# EAGLE design DMD_TWI (EAGLE 4.16)
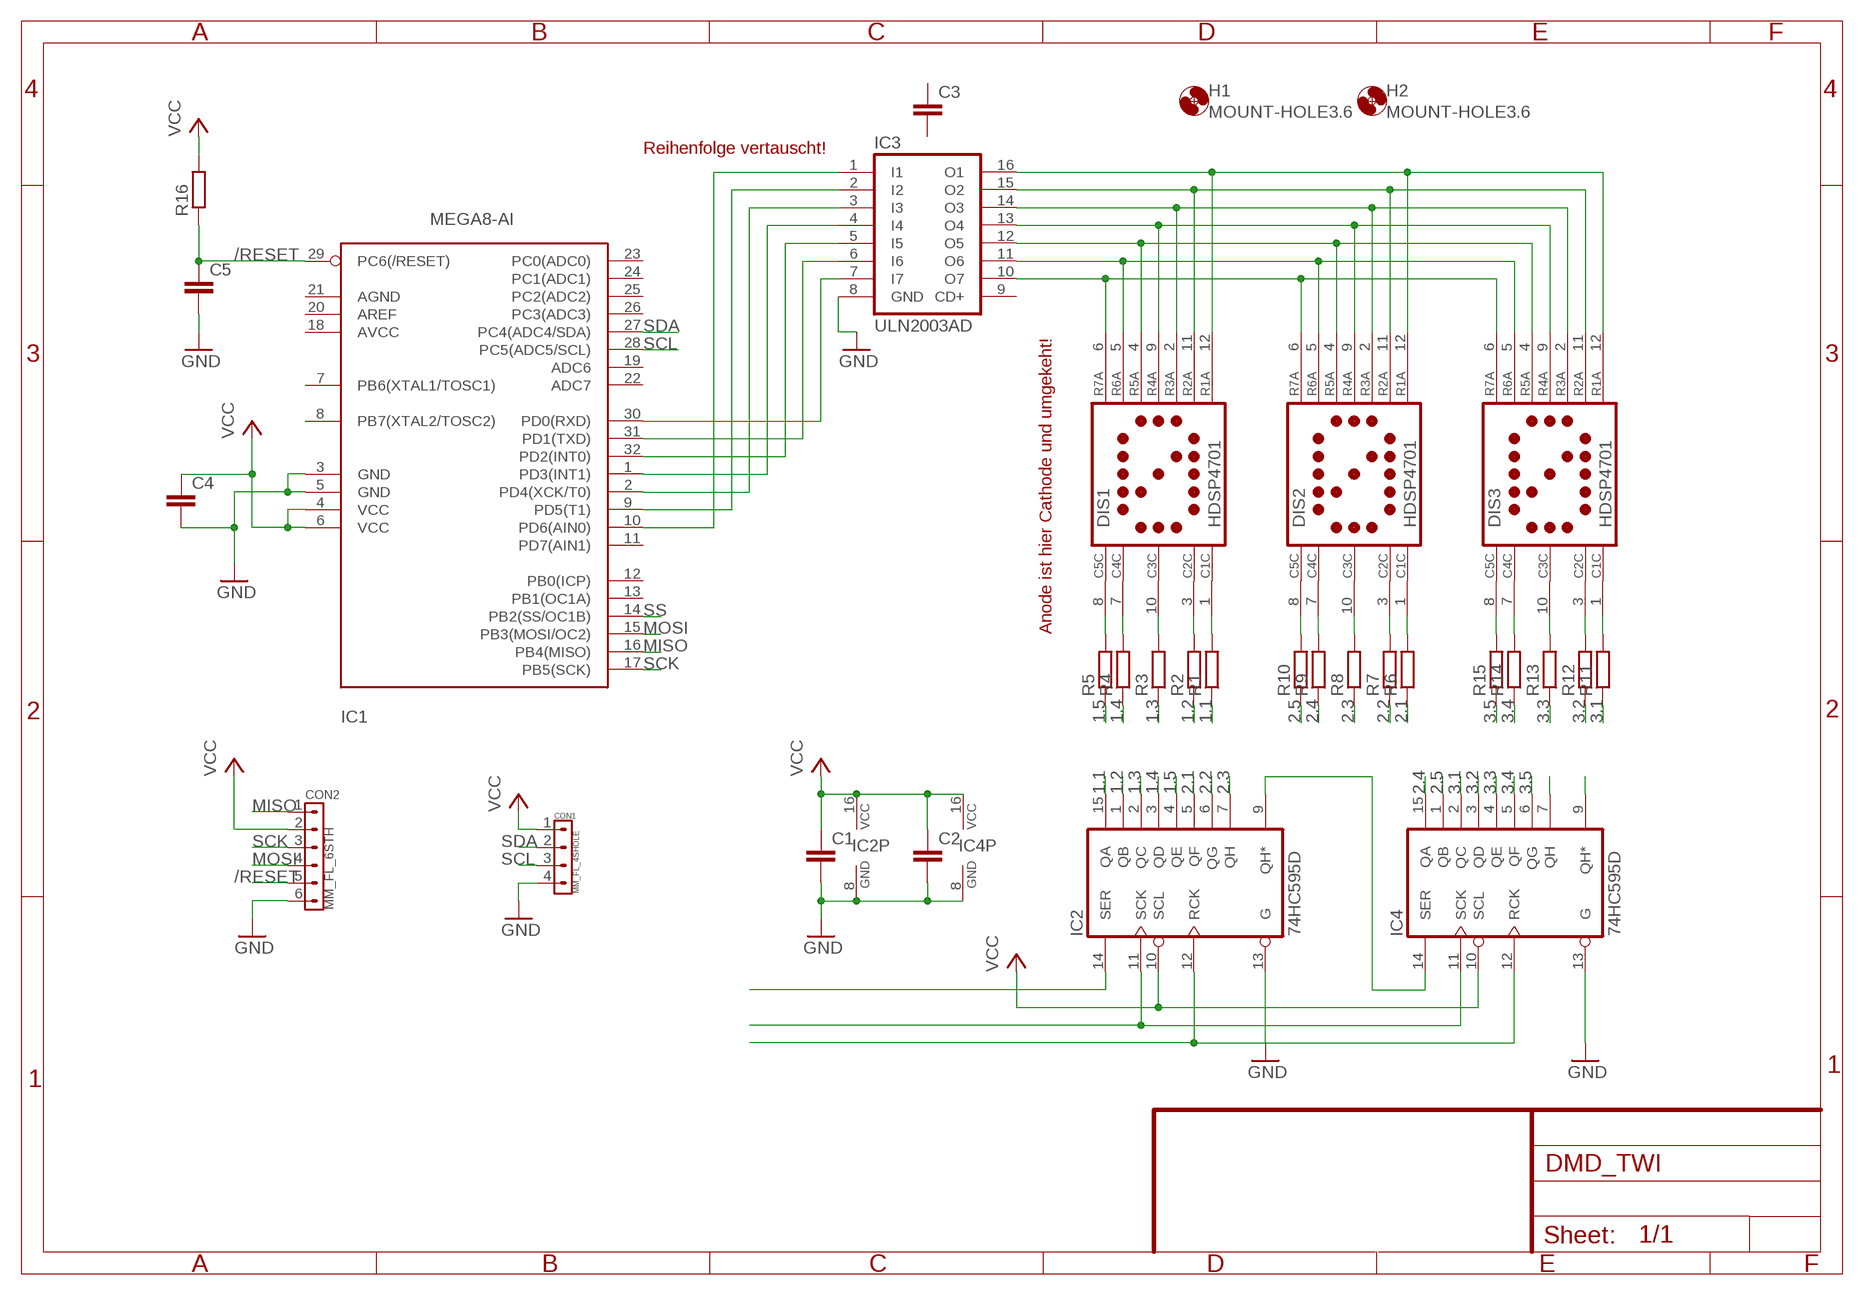
[diagram p0: schematic, sheet 1]

## Parts
C1  C-EUC0603  [C0603]
C2  C-EUC0603  [C0603]
C3  C-EUC0603  [C0603]
C4  C-EUC0603  [C0603]
C5  C-EUC0603  [C0603]
CON1  MM_FL_4SHOLE  [MM_FL_4G]
CON2  MM_FL_6STH  [MM_FL_6G]
DIS1  HDSP4701  [HDSP47]
DIS2  HDSP4701  [HDSP47]
DIS3  HDSP4701  [HDSP47]
H1  MOUNT-HOLE3.6  [3,6]
H2  MOUNT-HOLE3.6  [3,6]
IC1  MEGA8-AI  [TQFP32-08]
IC2  74HC595D  [SO16]
IC3  ULN2003AD  [SO16]
IC4  74HC595D  [SO16]
R1  R-EU_R0603  [R0603]
R2  R-EU_R0603  [R0603]
R3  R-EU_R0603  [R0603]
R4  R-EU_R0603  [R0603]
R5  R-EU_R0603  [R0603]
R6  R-EU_R0603  [R0603]
R7  R-EU_R0603  [R0603]
R8  R-EU_R0603  [R0603]
R9  R-EU_R0603  [R0603]
R10  R-EU_R0603  [R0603]
R11  R-EU_R0603  [R0603]
R12  R-EU_R0603  [R0603]
R13  R-EU_R0603  [R0603]
R14  R-EU_R0603  [R0603]
R15  R-EU_R0603  [R0603]
R16  R-EU_R0603  [R0603]

## Nets
1.1: IC2.15(QA) R1.1
1.2: IC2.1(QB) R2.1
1.3: IC2.2(QC) R3.1
1.4: IC2.3(QD) R4.1
1.5: IC2.4(QE) R5.1
2.1: IC2.5(QF) R6.1
2.2: IC2.6(QG) R7.1
2.3: IC2.7(QH) R8.1
2.4: IC4.15(QA) R9.1
2.5: IC4.1(QB) R10.1
3.1: IC4.2(QC) R11.1
3.2: IC4.3(QD) R12.1
3.3: IC4.4(QE) R13.1
3.4: IC4.5(QF) R14.1
3.5: IC4.6(QG) R15.1
/RESET: C5.1 CON2.5 IC1.29(PC6(/RESET)) R16.1
GND: C1.2 C2.2 C4.2 C5.2 CON1.4 CON2.6 IC1.3(GND) IC1.5(GND) IC2.8(GND) IC2.13(G) IC3.8(GND) IC4.8(GND) IC4.13(G)
MISO: CON2.1 IC1.16(PB4(MISO))
MOSI: CON2.4 IC1.15(PB3(MOSI/OC2))
N$1: DIS1.6(R7A) DIS2.6(R7A) DIS3.6(R7A) IC3.10(O7)
N$2: DIS1.5(R6A) DIS2.5(R6A) DIS3.5(R6A) IC3.11(O6)
N$3: DIS1.4(R5A) DIS2.4(R5A) DIS3.4(R5A) IC3.12(O5)
N$4: DIS1.9(R4A) DIS2.9(R4A) DIS3.9(R4A) IC3.13(O4)
N$5: DIS1.2(R3A) DIS2.2(R3A) DIS3.2(R3A) IC3.14(O3)
N$6: DIS1.11(R2A) DIS2.11(R2A) DIS3.11(R2A) IC3.15(O2)
N$7: DIS1.12(R1A) DIS2.12(R1A) DIS3.12(R1A) IC3.16(O1)
N$8: DIS1.8(C5C) R5.2
N$9: DIS1.7(C4C) R4.2
N$10: DIS1.10(C3C) R3.2
N$11: DIS1.3(C2C) R2.2
N$12: DIS1.1(C1C) R1.2
N$13: DIS2.8(C5C) R10.2
N$14: DIS2.7(C4C) R9.2
N$15: DIS2.10(C3C) R8.2
N$16: DIS2.3(C2C) R7.2
N$17: DIS2.1(C1C) R6.2
N$18: DIS3.8(C5C) R15.2
N$19: DIS3.7(C4C) R14.2
N$20: DIS3.10(C3C) R13.2
N$21: DIS3.3(C2C) R12.2
N$22: DIS3.1(C1C) R11.2
N$23: IC2.11(SCK) IC4.11(SCK)
N$24: IC2.14(SER)
N$25: IC2.12(RCK) IC4.12(RCK)
N$26: IC1.30(PD0(RXD)) IC3.7(I7)
N$27: IC1.31(PD1(TXD)) IC3.6(I6)
N$28: IC1.32(PD2(INT0)) IC3.5(I5)
N$29: IC1.1(PD3(INT1)) IC3.4(I4)
N$30: IC1.2(PD4(XCK/T0)) IC3.3(I3)
N$31: IC1.9(PD5(T1)) IC3.2(I2)
N$32: IC1.10(PD6(AIN0)) IC3.1(I1)
N$46: IC2.9(QH*) IC4.14(SER)
N$54: IC4.7(QH)
N$55: IC4.9(QH*)
SCK: CON2.3 IC1.17(PB5(SCK))
SCL: CON1.3 IC1.28(PC5(ADC5/SCL))
SDA: CON1.2 IC1.27(PC4(ADC4/SDA))
SS: IC1.14(PB2(SS/OC1B))
VCC: C1.1 C2.1 C4.1 CON1.1 CON2.2 IC1.4(VCC) IC1.6(VCC) IC2.10(SCL) IC2.16(VCC) IC4.10(SCL) IC4.16(VCC) R16.2
Unconnected: C3.1 C3.2 IC1.7(PB6(XTAL1/TOSC1)) IC1.8(PB7(XTAL2/TOSC2)) IC1.11(PD7(AIN1)) IC1.12(PB0(ICP)) IC1.13(PB1(OC1A)) IC1.18(AVCC) IC1.19(ADC6) IC1.20(AREF) IC1.21(AGND) IC1.22(ADC7) IC1.23(PC0(ADC0)) IC1.24(PC1(ADC1)) IC1.25(PC2(ADC2)) IC1.26(PC3(ADC3)) IC3.9(CD+)

## Notes on the sheet
- Reihenfolge vertauscht!
- Anode ist hier Cathode und umgekeht!

## Library data of the parts
C1-C5 = rcl:C-EU: CAPACITOR, European symbol
CON1 = marcus:MM_FL_4S: Miniatru Print Stecker SMD 4 Kontakte Reichelt Bestellnummer: MM FL 4S Created by Marcus Knips 4/2013
CON2 = marcus:MM_FL_6S: Miniatru Print Stecker SMD 6 Kontakte Reichelt Bestellnummer: MM FL 6S Created by Marcus Knips 4/2013
DIS1-DIS3 = test:HDSP4701: LED DISPLAY 1-character dot matrix without decimal point
H1 H2 = holes:MOUNT-HOLE: MOUNTING HOLE with drill center marker
IC1 = atmel:MEGA8: MICROCONTROLLER 8 Kbytes FLASH 1 kbytes SRAM 512 bytes EEPROM USART 6-channel 10 bit ADC 2-channel 8 bit ADC Source: avr.lbr
IC2 IC4 = 74xx-eu:74*595: 8-bit SHIFT REGISTER, output latch
IC3 = uln-udn:ULN2003A: DRIVER ARRAY
R1-R16 = rcl:R-EU_: RESISTOR, European symbol

## Board
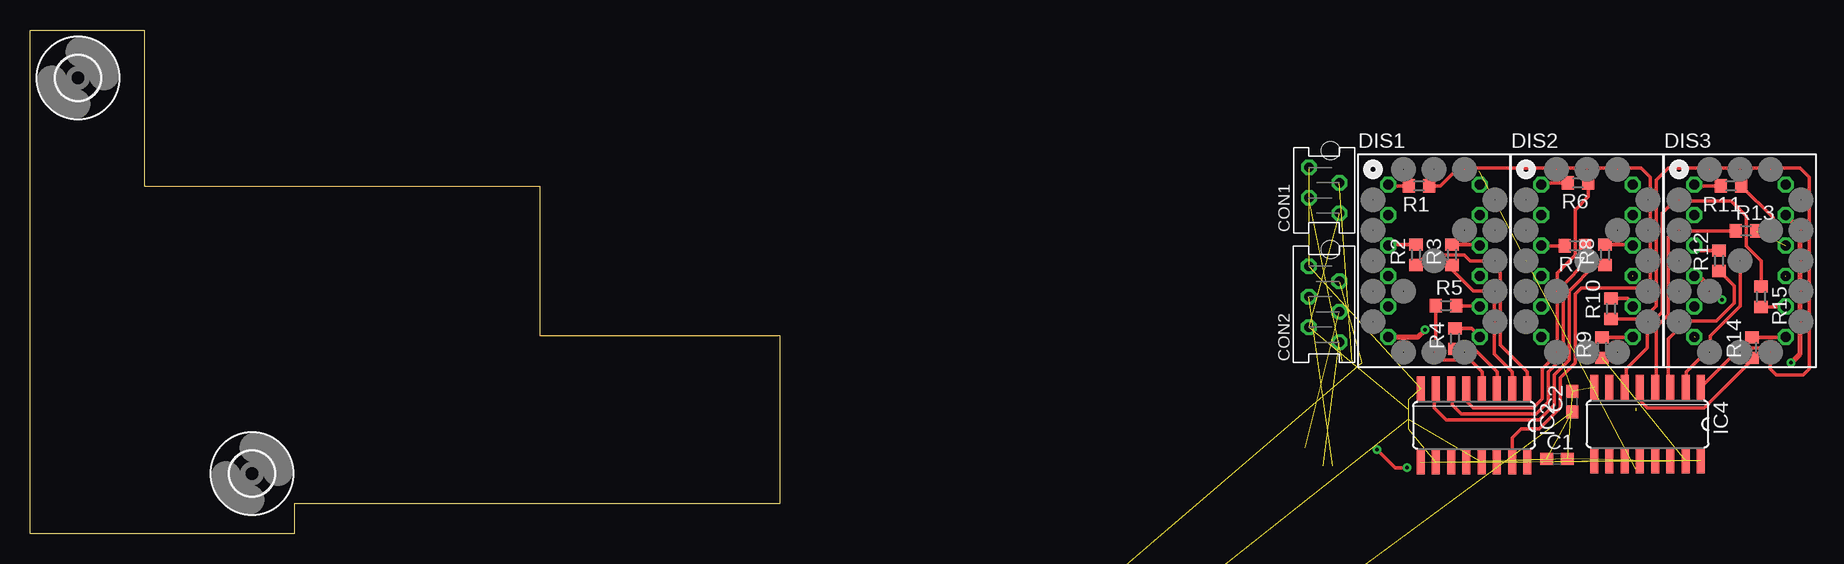
[diagram p1: board, top side]
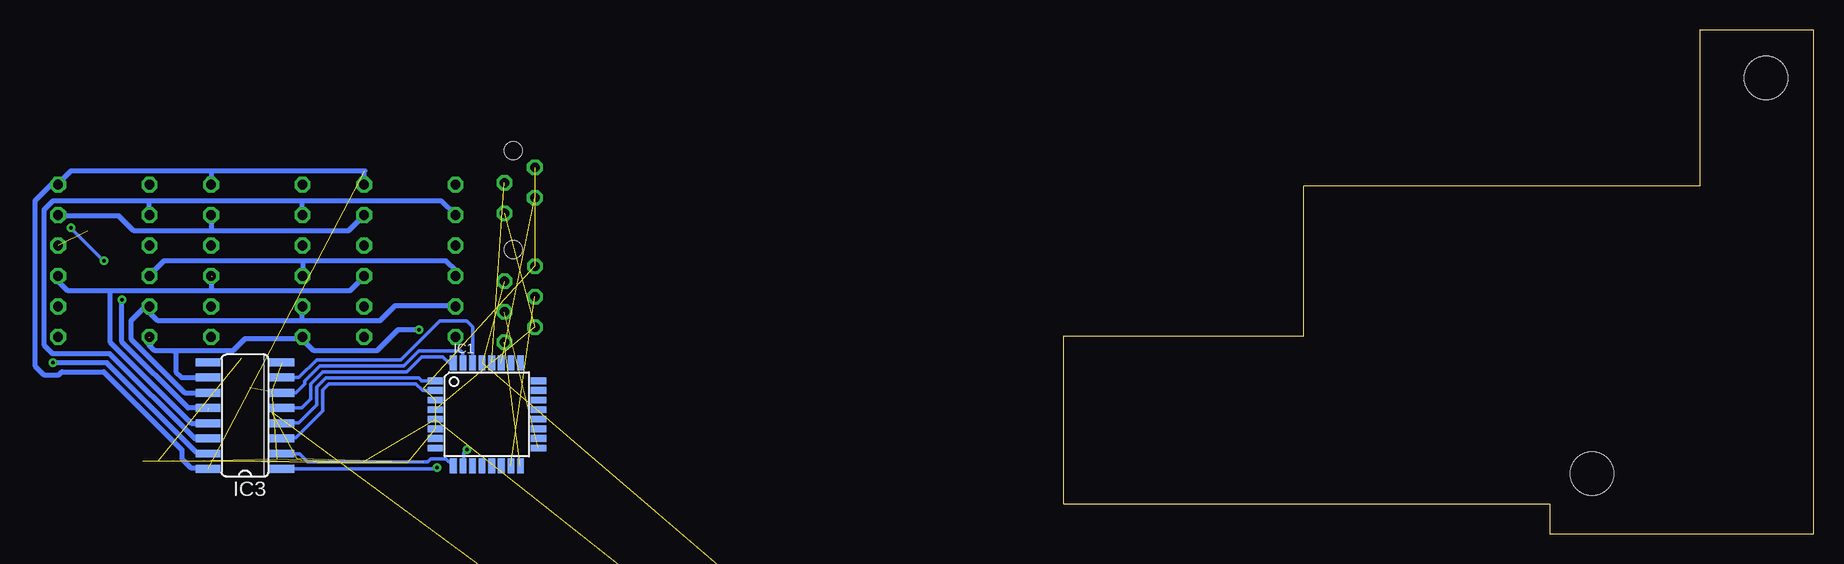
[diagram p2: board, bottom side, seen from below]

Size 62.5 x 42 mm. Coordinates in mm from the lower left corner, seen from the top.
Outline: 0,0 0,42 9.5,42 9.5,29 42.5,29 42.5,16.5 62.5,16.5 62.5,2.5 22,2.5 22,0 0,0
Copper layers (1*16): Top 0.035mm / dielectric 1.5mm / Bottom 0.035mm
Design rules "default": minimum track width 10mil, minimum drill 24mil, track to track 8mil, track to pad 8mil, pad to pad 8mil, via to via 8mil, smd to smd 8mil, copper to edge 40mil, drill to drill 8mil, minimum pad ring 10mil, minimum via ring 8mil, stop-mask expansion 4mil, vias tented up to drill 0mil, thermal gap 10mil

### Footprints (pad centres in the part's own frame; a part is rotated, then mirrored left to right if it is on the bottom)
C0603 = smd 1.1 x 1: 1 -0.85,0; 2 0.85,0
MM_FL_4G = drill 0.8 octagon: 1 0,-1.27; 2 1.27,1.27; 3 2.54,-1.27; 4 3.81,1.27 | hole 1.5: 5.21,-0.53
MM_FL_6G = drill 0.8 octagon: 1 -2.54,-1.27; 2 -1.27,1.27; 3 0,-1.27; 4 1.27,1.27; 5 2.54,-1.27; 6 3.81,1.27 | hole 1.5: 5.21,-0.53
HDSP47 = drill 0.813 octagon: 1 -3.81,6.35; 2 -3.81,3.81; 3 -3.81,1.27; 4 -3.81,-1.27; 5 -3.81,-3.81; 6 -3.81,-6.35; 7 3.81,-6.35; 8 3.81,-3.81; 9 3.81,-1.27; 10 3.81,1.27; 11 3.81,3.81; 12 3.81,6.35
3,6 = hole 3.6: 0,0
TQFP32-08 = smd 1.27 x 0.559: 1 -4.293,2.8; 2 -4.293,2; 3 -4.293,1.2; 4 -4.293,0.4; 5 -4.293,-0.4; 6 -4.293,-1.2; 7 -4.293,-2; 8 -4.293,-2.8; 17 4.293,-2.8; 18 4.293,-2; 19 4.293,-1.2; 20 4.293,-0.4; 21 4.293,0.4; 22 4.293,1.2; 23 4.293,2; 24 4.293,2.8 | smd 0.559 x 1.27: 9 -2.8,-4.293; 10 -2,-4.293; 11 -1.2,-4.293; 12 -0.4,-4.293; 13 0.4,-4.293; 14 1.2,-4.293; 15 2,-4.293; 16 2.8,-4.293; 25 2.8,4.293; 26 2,4.293; 27 1.2,4.293; 28 0.4,4.293; 29 -0.4,4.293; 30 -1.2,4.293; 31 -2,4.293; 32 -2.8,4.293
SO16 = smd 0.66 x 2.032: 1 -4.445,-3.073; 2 -3.175,-3.073; 3 -1.905,-3.073; 4 -0.635,-3.073; 5 0.635,-3.073; 6 1.905,-3.073; 7 3.175,-3.073; 8 4.445,-3.073; 9 4.445,3.073; 10 3.175,3.073; 11 1.905,3.073; 12 0.635,3.073; 13 -0.635,3.073; 14 -1.905,3.073; 15 -3.175,3.073; 16 -4.445,3.073
R0603 = smd 1 x 1.1: 1 -0.85,0; 2 0.85,0

### Placement (x,y rotation side)
C1  127.25,6.25 0 top  (outside the outline)
C2  128.5,11 90 top  (outside the outline)
C3  -83.55,-140.7 0 top  (outside the outline)
C4  -83.55,-147.05 0 top  (outside the outline)
C5  -83.55,-153.4 0 top  (outside the outline)
CON1  107.85,26.72 90 top  (outside the outline)
CON2  107.84,18.49 90 top  (outside the outline)
DIS1  117,22.75 0 top  (outside the outline)
DIS2  129.75,22.75 0 top  (outside the outline)
DIS3  142.5,22.75 0 top  (outside the outline)
H1  18.5,5 0 top
H2  4,38 0 top
IC1  110.58,9.94 0 bottom  (outside the outline)
IC2  120.33,9.02 180 top  (outside the outline)
IC3  130.73,9.84 90 bottom  (outside the outline)
IC4  134.79,9.12 180 top  (outside the outline)
R1  115.75,29 180 top  (outside the outline)
R2  115.5,23.25 90 top  (outside the outline)
R3  118.5,23.25 90 top  (outside the outline)
R4  118.75,16.25 90 top  (outside the outline)
R5  118,19 0 top  (outside the outline)
R6  129,29.25 180 top  (outside the outline)
R7  128.75,24 180 top  (outside the outline)
R8  131.25,23.25 90 top  (outside the outline)
R9  131,15.5 90 top  (outside the outline)
R10  131.75,18.75 90 top  (outside the outline)
R11  141.75,29 180 top  (outside the outline)
R12  140.75,22.75 90 top  (outside the outline)
R13  143,25.25 0 top  (outside the outline)
R14  143.5,15.5 90 top  (outside the outline)
R15  144.25,19.75 270 top  (outside the outline)
R16  -82.28,-159.75 0 top  (outside the outline)

### Tracks (layer width: path | path; a pad name or v marks a point on that pad's centre or on a via)
1.1
  Top 0.3: R1.1 117.5,29 119,30.5 134.25,30.5 135,29.75 135,21.25 134.25,20.5 129.25,20.5 128.75,20 128.75,14.25 127.5,13 127.5,10.5 125.75,8.75 124.25,8.75 123.5,8 123.5,6 IC2.15
1.2
  Top 0.3: R2.1 116.35,23.25 119.5,23.25 120,22.75 121.5,22.75 122.5,21.75 122.5,15.75 124.75,13.5 124.75,12.25 124.78,12.22 IC2.1
  Top 0.4: R2.1 115.5,22.5
1.3
  Top 0.3: R3.1 118.5,22 120.25,20.25 121.25,20.25 122,19.5 122,15 123.5,13.5 123.5,12 123.5,12.01 IC2.2
1.4
  Top 0.3: R4.1 120.35,15.4 122.25,13.5 122.25,12 122.23,12.02 IC2.3
1.5
  Top 0.3: R5.1 117.15,15.1 117.75,14.5 120,14.5 121,13.5 121,12 120.97,12.04 IC2.4
2.1
  Top 0.3: R6.1 129.85,28.1 128.75,27 128.75,23.25 127.25,21.75 127.25,15 126,13.75 126,11.25 125.25,10.5 120.25,10.5 119.75,11 119.75,12.25 119.69,12.2 IC2.5
2.2
  Top 0.3: R7.1 129.6,22.6 127.75,20.75 127.75,14.75 126.5,13.5 126.5,11 125.5,10 119.25,10 118.5,10.75 118.5,12 118.42,12.07 IC2.6
2.3
  Top 0.3: R8.1 130.4,22.4 128.25,20.25 128.25,14.5 127,13.25 127,10.75 125.75,9.5 118,9.5 117,10.5 117,11.75 117.25,12 IC2.7
2.4  (1 unrouted)
2.5
  Top 0.3: R10.1 134.4,17.9 135.5,19 135.5,29.5 136.5,30.5 147.5,30.5 148.25,29.75 148.25,13.75 147.75,13.25 145.5,13.25 145,13.75 145,15.25 144.75,15.5 142.5,15.5 139.25,12.25 | 139.25,12.25 139.24,12.23 IC4.1 139.25,12.21 139.25,12.25
3.1  (via drill 0.3)
  Top 0.3: R11.1 145.25,26.35 v145.25,25.5 | v142.5,22.75 142.5,19 140,16.5 140,15.5 138,13.5 138,12.23 IC4.2
  Bottom 0.3: v145.25,25.5 v142.5,22.75
3.2
  Top 0.3: R12.1 142,20.65 142,19.25 140.5,17.75 138,17.75 136.5,16.25 136.5,12.25 136.64,12.25 IC4.3
3.3
  Top 0.3: R13.1 137,25.25 136.5,24.75 136.5,18.25 135.5,17.25 135.5,12.25 135.48,12.25 IC4.4
3.4
  Top 0.3: R14.1 143.5,14.5 139.5,10.5 134.75,10.5 134.25,11 134.25,12.25 134.19,12.19 IC4.5
3.5
  Top 0.3: R15.1 144.25,22.75 143,24 143,26.5 141.75,27.75 137,27.75 136,26.75 136,18.5 134.75,17.25 134.75,15.5 133,13.75 133,12.25 132.94,12.19 IC4.6
/RESET  (3 unrouted)
GND  (12 unrouted)
MISO  (1 unrouted)
MOSI  (1 unrouted)
N$1  (via drill 0.3)  (1 unrouted)
  Top 0.4: DIS1.6 115.65,16.4 v116.25,17
  Bottom 0.4: 136.75,15.25 136.5,15.25 136.5,13.5 136.01,13.02 IC3.10 | 136.75,15.25 138.25,15.25 138.75,15.75 138.75,16.34 | 126,16.25 130.75,16.25 131.75,15.25 136.75,15.25 | 118.75,16.25 119.75,15.25 125,15.25 126,16.25 | 118.75,16.25 118.69,16.31 | 126,16.25 125.94,16.31 DIS2.6 | v116.25,17 118,17 118.75,16.25
N$2
  Bottom 0.4: 126,17.75 138,17.75 138.75,18.5 138.75,19 DIS3.5 138.94,18.94 139,19 140.25,17.75 140.25,16.25 135.75,11.75 IC3.11 | IC3.11 133.75,11.75 | IC3.11 | DIS1.5 113.25,19 118.25,19 119.5,17.75 126,17.75 | DIS2.5 126,19 126,17.75
N$3  (via drill 0.3)  (1 unrouted)
  Top 0.4: DIS3.4 138.71,21.5 139,21.5 v141,19.5
  Bottom 0.4: DIS1.4 113.19,21.94 114,22.75 126,22.75 | DIS3.4 138.73,21.48 138.75,21.5 137.5,22.75 126,22.75 | DIS2.4 125.94,22.69 126,22.75 | IC3.12 135.47,10.47 141,16 v141,19.5
N$4  (2 unrouted)
  Bottom 0.4: 133.5,20.25 142,20.25 | 142,20.25 145.5,20.25 146.25,21 146.25,21.5 146.29,21.5 | 133.5,20.25 133.5,21.42 | 120.77,21.48 120.75,21.5 | DIS1.9 120.77,21.48 | 133.5,20.25 122,20.25 120.77,21.48 | IC3.13 135.21,9.21 142,16 142,20.25
N$5
  Bottom 0.4: DIS1.2 114.38,27.75 126,27.75 | 126,27.75 138.75,27.75 | DIS3.2 138.75,26.62 138.75,27.75 | DIS2.2 126,26.62 126,27.75 | 138.75,27.75 146.75,27.75 147.5,27 147.5,15.75 146.75,15 142,15 134.94,7.94 IC3.14
N$6  (via drill 0.3)
  Top 0.4: v146.75,14.25 147.5,15 147.5,25.37 146.37,26.5 146.25,26.5 DIS3.11
  Bottom 0.4: DIS1.11 122.12,25.25 133.5,25.25 | DIS2.11 133.5,26.5 133.5,25.25 | IC3.15 133.8,6.7 133.75,6.75 134.75,6.75 142.25,14.25 v146.75,14.25 | 133.5,25.25 140,25.25 141.25,26.5 146.25,26.5 DIS3.11
N$7  (1 unrouted)
  Bottom 0.4: 133.5,30.25 120.75,30.25 120.81,30.19 DIS1.12 | 133.5,30.25 145.25,30.25 146.31,29.19 DIS3.12 146.9,29.1 148.25,27.75 148.25,14 147.5,13.25 146.25,13.25 146,13.5 142.5,13.5 136,7 136,6.25 135.25,5.5 133.75,5.5 133.8,5.45 IC3.16 | DIS2.12 133.56,30.19 133.5,30.25
N$8
  Top 0.3: DIS1.8 120.75,19 R5.2
N$9
  Top 0.3: 121,16.25 120.85,16.4 | 120.85,16.4 DIS1.7 | R4.2 120.15,17.1 120.85,16.4
N$10
  Top 0.3: DIS1.10 120.77,24.02 120.75,24 120.65,24.1 R3.2
N$11
  Top 0.3: DIS1.3 113.23,24.02 113.25,24 113.35,24.1 R2.2
N$12
  Top 0.3: DIS1.1 113.19,29.06 113.25,29 R1.2
N$13
  Top 0.3: DIS2.8 133.69,18.94 133.75,19 133.15,19.6 R10.2
N$14
  Top 0.3: DIS2.7 133.56,16.44 133.5,16.5 133.35,16.35 R9.2
N$15
  Top 0.3: 133.75,24 133.73,24.02 | 133.73,24.02 DIS2.10 | R8.2 133.65,24.1 133.73,24.02
N$16
  Top 0.3: DIS2.3 125.98,24.02 126,24 R7.2
N$17
  Top 0.3: DIS2.1 125.94,29.06 126,29 126.25,29.25 R6.2
N$18
  Top 0.3: DIS3.8 146.25,19 146.15,18.9 R15.2
N$19
  Top 0.3: 146.5,16.5 146.4,16.4 | 146.4,16.4 DIS3.7 | R14.2 146.35,16.35 146.4,16.4
N$20  (1 unrouted)
N$21
  Top 0.3: DIS3.3 138.73,24.02 139.15,23.6 R12.2
N$22
  Top 0.3: 138.5,29.25 138.65,29.1 | 138.65,29.1 DIS3.1 | R11.2 138.75,29 138.65,29.1
N$23  (1 unrouted)
N$25  (1 unrouted)
N$26
  Bottom 0.3: IC3.7 126.23,13.02 124.75,14.5 117.75,14.5 114.5,17.75 112.25,17.75 111.75,17.25 111.75,14 111.78,14.03 IC1.30
N$27
  Bottom 0.3: IC1.31 112.58,15.08 112.75,15.25 116.25,15.25 117.5,14 124.5,14 125.75,12.75 125.75,12.5 126.5,11.75 127.75,11.75 127.75,11.74 IC3.6
N$28
  Bottom 0.3: IC1.32 113.73,14.23 114.25,14.75 116,14.75 117.25,13.5 124.25,13.5 125.25,12.5 125.25,11.25 126,10.5 127.63,10.5 IC3.5
N$29
  Bottom 0.3: IC3.4 127.96,9.21 128,9.25 126.25,9.25 124.75,10.75 124.75,12.25 124,13 116.25,13 116,12.75 114.86,12.75 | 114.75,12.75 114.86,12.75 | 114.86,12.75 IC1.1
N$30
  Bottom 0.3: IC3.3 127.94,7.94 128,8 126.5,8 124.25,10.25 124.25,12 123.75,12.5 116.5,12.5 115.94,11.94 IC1.2
N$31
  Bottom 0.3: IC3.2 126.17,6.67 125.5,6 115.5,6 115.25,6.25 114,6.25 113.39,5.64 IC1.9
N$32  (via drill 0.3)
  Top 0.3: v114.75,5.5 113.75,5.5 v112.25,7
  Bottom 0.3: IC3.1 114.86,5.39 v114.75,5.5 | 112.5,5.5 112.5,5.57 | 112.5,5.57 IC1.10 | v112.25,7 112.5,6.75 112.5,5.57
N$46  (1 unrouted)
SCK  (1 unrouted)
SCL  (1 unrouted)
SDA  (1 unrouted)
VCC  (11 unrouted)